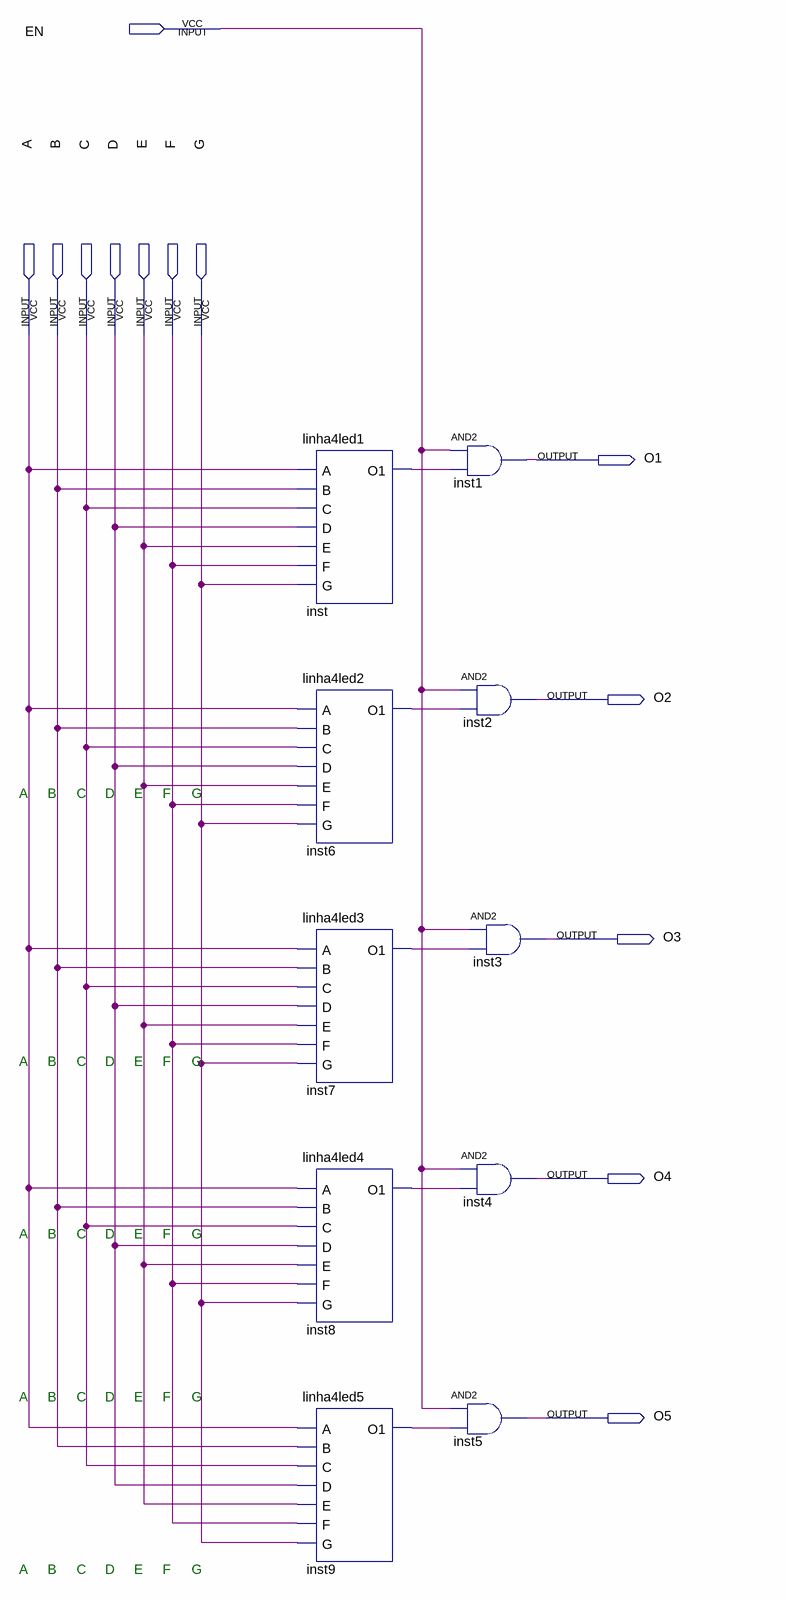
[diagram p0: schematic sheet]
// Quartus schematic linha4.bdf as structural Verilog: 10 symbols, 13 pins
module linha4 (
  input  EN,
  input  A,
  input  B,
  input  C,
  input  D,
  input  E,
  input  F,
  input  G,
  output O1,
  output O2,
  output O3,
  output O4,
  output O5
);

  wire inst6_o1, inst7_o1, inst8_o1, inst9_o1, inst_o1;

  linha4led1 inst (.A(A), .B(B), .C(C), .D(D), .E(E), .F(F), .G(G), .O1(inst_o1));
  linha4led2 inst6 (.A(A), .B(B), .C(C), .D(D), .E(E), .F(F), .G(G), .O1(inst6_o1));
  linha4led3 inst7 (.A(A), .B(B), .C(C), .D(D), .E(E), .F(F), .G(G), .O1(inst7_o1));
  linha4led4 inst8 (.A(A), .B(B), .C(C), .D(D), .E(E), .F(F), .G(G), .O1(inst8_o1));
  linha4led5 inst9 (.A(A), .B(B), .C(C), .D(D), .E(E), .F(F), .G(G), .O1(inst9_o1));
  and inst1 (O1, EN, inst_o1);
  and inst2 (O2, EN, inst6_o1);
  and inst3 (O3, EN, inst7_o1);
  and inst4 (O4, EN, inst8_o1);
  and inst5 (O5, EN, inst9_o1);

  // Notes on the sheet:
  //   A
  //   B
  //   C
  //   D
  //   E
  //   F
  //   G
  //   A
  //   B
  //   C
  //   D
  //   E
  //   F
  //   G
  //   A
  //   B
  //   C
  //   D
  //   E
  //   F
  //   G
  //   A
  //   B
  //   C
  //   D
  //   E
  //   F
  //   G
  //   A
  //   B
  //   C
  //   D
  //   E
  //   F
  //   G
endmodule
